# EAGLE design untitled (EAGLE 9.6.2)
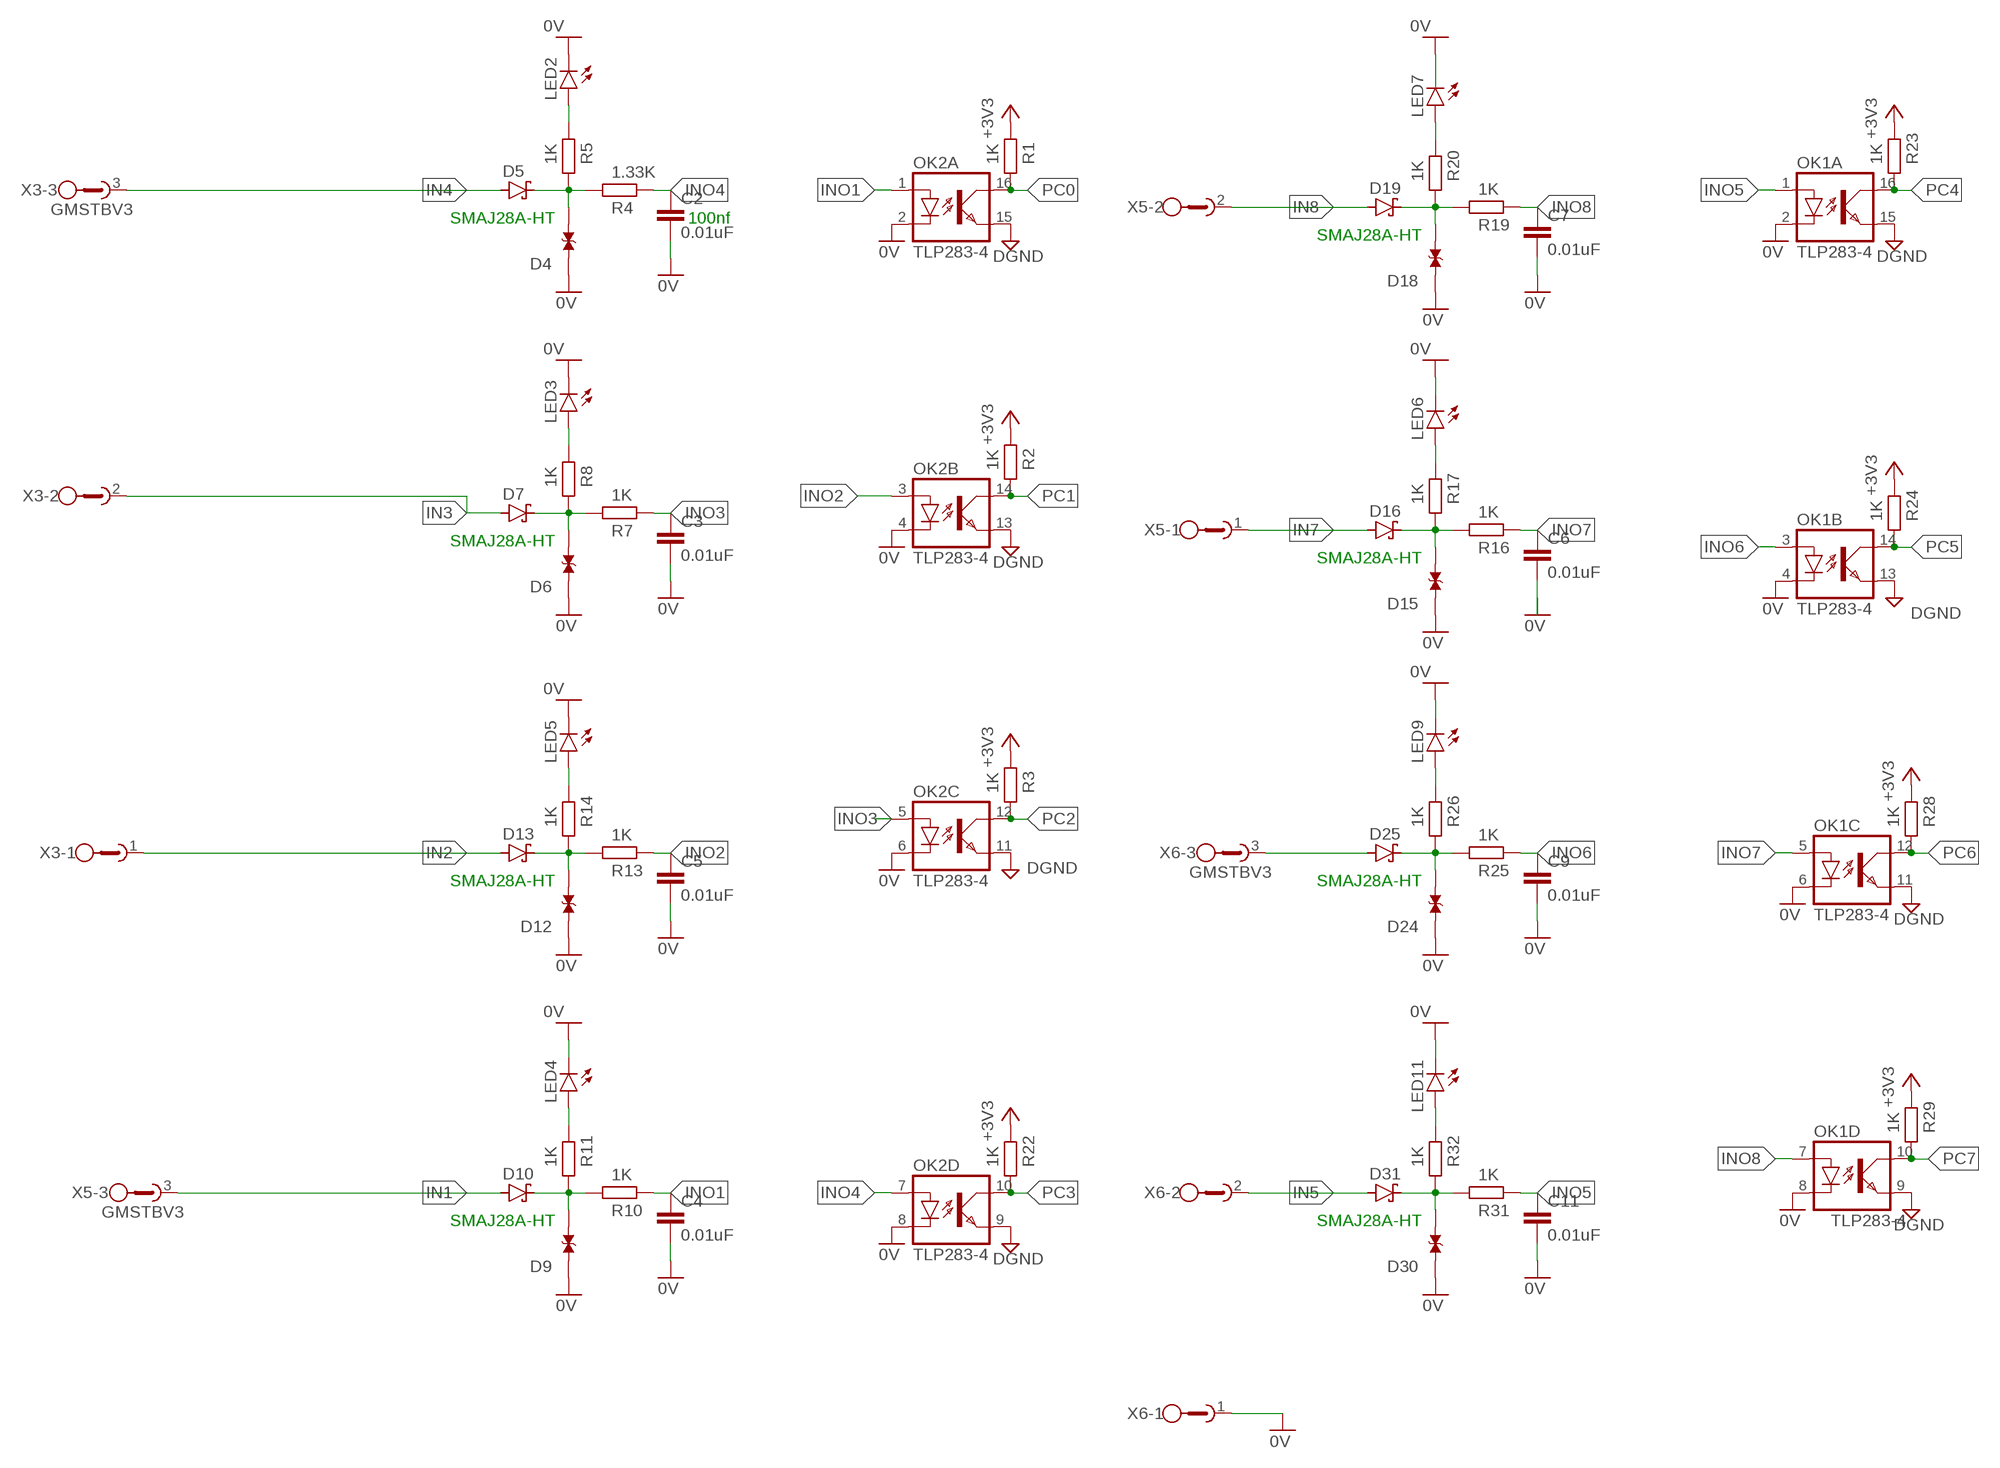
[diagram p0: schematic, sheet 1, part 1 of 2]
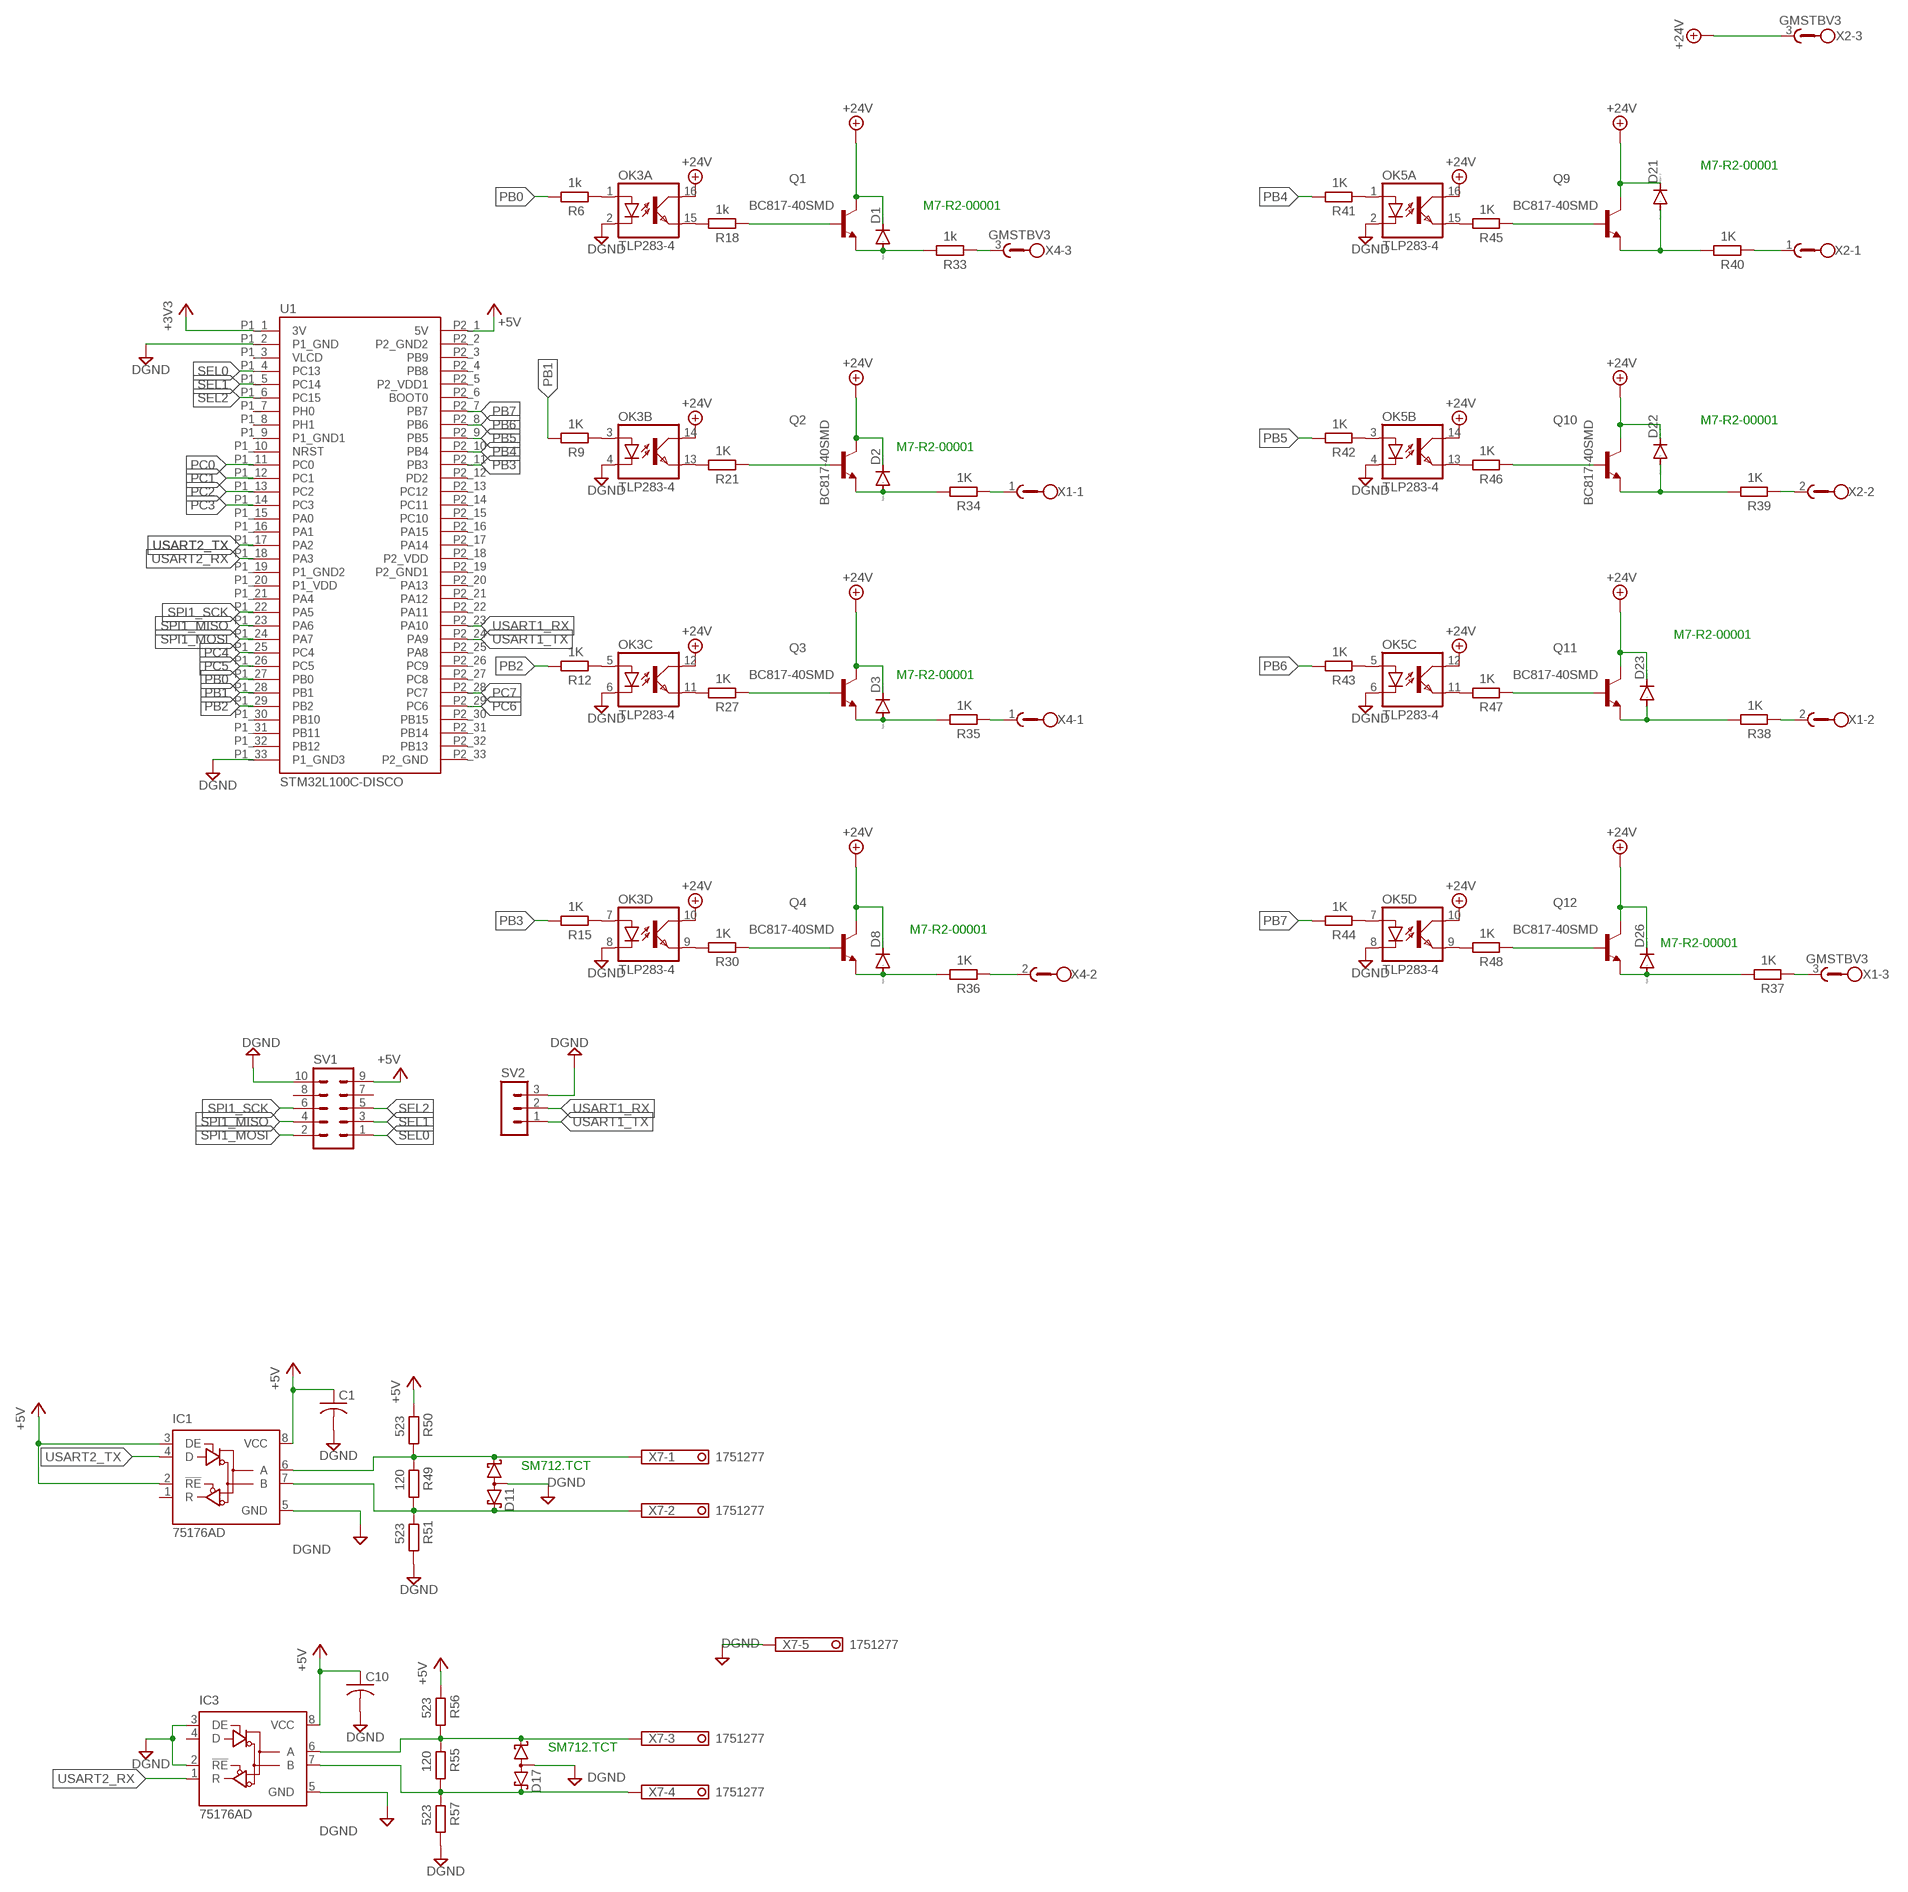
[diagram p1: schematic, sheet 1, part 2 of 2]

## Parts
C1  C-USC0805  [C0805]
C2  0.01uF  C-EUC0805  [C0805]
C3  0.01uF  C-EUC0805  [C0805]
C4  0.01uF  C-EUC0805  [C0805]
C5  0.01uF  C-EUC0805  [C0805]
C6  0.01uF  C-EUC0805  [C0805]
C7  0.01uF  C-EUC0805  [C0805]
C9  0.01uF  C-EUC0805  [C0805]
C10  C-USC0805  [C0805]
C11  0.01uF  C-EUC0805  [C0805]
D1  S1M  [SMA]
D2  S1M  [SMA]
D3  S1M  [SMA]
D4  SMAJ28CA  [DIOM4325X250N]
D5  SCHOTTKY-DIODESMD  [SMB]
D6  SMAJ28CA  [DIOM4325X250N]
D7  SCHOTTKY-DIODESMD  [SMB]
D8  S1M  [SMA]
D9  SMAJ28CA  [DIOM4325X250N]
D10  SCHOTTKY-DIODESMD  [SMB]
D11  BAS40-06  [SOT23]
D12  SMAJ28CA  [DIOM4325X250N]
D13  SCHOTTKY-DIODESMD  [SMB]
D15  SMAJ28CA  [DIOM4325X250N]
D16  SCHOTTKY-DIODESMD  [SMB]
D17  BAS40-06  [SOT23]
D18  SMAJ28CA  [DIOM4325X250N]
D19  SCHOTTKY-DIODESMD  [SMB]
D21  S1M  [SMA]
D22  S1M  [SMA]
D23  S1M  [SMA]
D24  SMAJ28CA  [DIOM4325X250N]
D25  SCHOTTKY-DIODESMD  [SMB]
D26  S1M  [SMA]
D30  SMAJ28CA  [DIOM4325X250N]
D31  SCHOTTKY-DIODESMD  [SMB]
IC1  75176AD  [D_R-PDSO-G8]
IC3  75176AD  [D_R-PDSO-G8]
LED2  LEDCHIP-LED0805  [CHIP-LED0805]
LED3  LEDCHIP-LED0805  [CHIP-LED0805]
LED4  LEDCHIP-LED0805  [CHIP-LED0805]
LED5  LEDCHIP-LED0805  [CHIP-LED0805]
LED6  LEDCHIP-LED0805  [CHIP-LED0805]
LED7  LEDCHIP-LED0805  [CHIP-LED0805]
LED9  LEDCHIP-LED0805  [CHIP-LED0805]
LED11  LEDCHIP-LED0805  [CHIP-LED0805]
OK1  TLP283-4  [MINI-FLAT-16]
OK2  TLP283-4  [MINI-FLAT-16]
OK3  TLP283-4  [MINI-FLAT-16]
OK5  TLP283-4  [MINI-FLAT-16]
Q1  BC817-40SMD  [SOT23-BEC]
Q2  BC817-40SMD  [SOT23-BEC]
Q3  BC817-40SMD  [SOT23-BEC]
Q4  BC817-40SMD  [SOT23-BEC]
Q9  BC817-40SMD  [SOT23-BEC]
Q10  BC817-40SMD  [SOT23-BEC]
Q11  BC817-40SMD  [SOT23-BEC]
Q12  BC817-40SMD  [SOT23-BEC]
R1  1K  R-EU_R0805  [R0805]
R2  1K  R-EU_R0805  [R0805]
R3  1K  R-EU_R0805  [R0805]
R4  1.33K  R-EU_R0805  [R0805]
R5  1K  R-EU_R0805  [R0805]
R6  1k  R-EU_R0805  [R0805]
R7  1K  R-EU_R0805  [R0805]
R8  1K  R-EU_R0805  [R0805]
R9  1K  R-EU_R0805  [R0805]
R10  1K  R-EU_R0805  [R0805]
R11  1K  R-EU_R0805  [R0805]
R12  1K  R-EU_R0805  [R0805]
R13  1K  R-EU_R0805  [R0805]
R14  1K  R-EU_R0805  [R0805]
R15  1K  R-EU_R0805  [R0805]
R16  1K  R-EU_R0805  [R0805]
R17  1K  R-EU_R0805  [R0805]
R18  1k  R-EU_R0805  [R0805]
R19  1K  R-EU_R0805  [R0805]
R20  1K  R-EU_R0805  [R0805]
R21  1K  R-EU_R0805  [R0805]
R22  1K  R-EU_R0805  [R0805]
R23  1K  R-EU_R0805  [R0805]
R24  1K  R-EU_R0805  [R0805]
R25  1K  R-EU_R0805  [R0805]
R26  1K  R-EU_R0805  [R0805]
R27  1K  R-EU_R0805  [R0805]
R28  1K  R-EU_R0805  [R0805]
R29  1K  R-EU_R0805  [R0805]
R30  1K  R-EU_R0805  [R0805]
R31  1K  R-EU_R0805  [R0805]
R32  1K  R-EU_R0805  [R0805]
R33  1k  R-EU_R0805  [R0805]
R34  1K  R-EU_R0805  [R0805]
R35  1K  R-EU_R0805  [R0805]
R36  1K  R-EU_R0805  [R0805]
R37  1K  R-EU_R0805  [R0805]
R38  1K  R-EU_R0805  [R0805]
R39  1K  R-EU_R0805  [R0805]
R40  1K  R-EU_R0805  [R0805]
R41  1K  R-EU_R0805  [R0805]
R42  1K  R-EU_R0805  [R0805]
R43  1K  R-EU_R0805  [R0805]
R44  1K  R-EU_R0805  [R0805]
R45  1K  R-EU_R0805  [R0805]
R46  1K  R-EU_R0805  [R0805]
R47  1K  R-EU_R0805  [R0805]
R48  1K  R-EU_R0805  [R0805]
R49  120  R-EU_R0805  [R0805]
R50  523  R-EU_R0805  [R0805]
R51  523  R-EU_R0805  [R0805]
R55  120  R-EU_R0805  [R0805]
R56  523  R-EU_R0805  [R0805]
R57  523  R-EU_R0805  [R0805]
SV1  MA05-2  [MA05-2]
SV2  MA03-1  [MA03-1]
U1  STM32L100C-DISCO  [DEV_STM32L100C-DISCO]
X1  GMSTBV3  [GMSTBV3]
X2  GMSTBV3  [GMSTBV3]
X3  GMSTBV3  [GMSTBV3]
X4  GMSTBV3  [GMSTBV3]
X5  GMSTBV3  [GMSTBV3]
X6  GMSTBV3  [GMSTBV3]
X7  1751277  [1751277]

## Nets
0V: C2.2 C3.2 C4.2 C5.2 C6.2 C7.2 C9.2 C11.2 D4.1 D6.1 D9.1 D12.1 D15.1 D18.1 D24.1 D30.1 LED2.C LED3.C LED4.C LED5.C LED6.C LED7.C LED9.C LED11.C OK1.2(A:C) OK1.4(B:C) OK1.6(C:C) OK1.8(D:C) OK2.2(A:C) OK2.4(B:C) OK2.6(C:C) OK2.8(D:C) X6.1
+3V3: R1.2 R2.2 R3.2 R22.2 R23.2 R24.2 R28.2 R29.2 U1.P1_1(3V)
+5V: C1.1 C10.1 IC1.2(!RE) IC1.3(DE) IC1.8(VCC) IC3.8(VCC) R50.2 R56.2 SV1.9 U1.P2_1(5V)
+24V: D1.C D2.C D3.C D8.C D21.C D22.C D23.C D26.C OK3.10(D:COL) OK3.12(C:COL) OK3.14(B:COL) OK3.16(A:COL) OK5.10(D:COL) OK5.12(C:COL) OK5.14(B:COL) OK5.16(A:COL) Q1.C Q2.C Q3.C Q4.C Q9.C Q10.C Q11.C Q12.C X2.3
DGND: C1.2 C10.2 D11.3(AA) D17.3(AA) IC1.5(GND) IC3.2(!RE) IC3.3(DE) IC3.5(GND) OK1.9(D:EMIT) OK1.11(C:EMIT) OK1.13(B:EMIT) OK1.15(A:EMIT) OK2.9(D:EMIT) OK2.11(C:EMIT) OK2.13(B:EMIT) OK2.15(A:EMIT) OK3.2(A:C) OK3.4(B:C) OK3.6(C:C) OK3.8(D:C) OK5.2(A:C) OK5.4(B:C) OK5.6(C:C) OK5.8(D:C) R51.1 R57.1 SV1.10 SV2.3 U1.P1_2(P1_GND) U1.P1_33(P1_GND3) X7.5
IN1: D10.A X5.3
IN2: D13.A X3.1
IN3: D7.A X3.2
IN4: D5.A X3.3
IN5: D31.A X6.2
IN7: D16.A X5.1
IN8: D19.A X5.2
INO1: C4.1 OK2.1(A:A) R10.2
INO2: C5.1 OK2.3(B:A) R13.2
INO3: C3.1 OK2.5(C:A) R7.2
INO4: C2.1 OK2.7(D:A) R4.2
INO5: C11.1 OK1.1(A:A) R31.2
INO6: C9.1 OK1.3(B:A) R25.2
INO7: C6.1 OK1.5(C:A) R16.2
INO8: C7.1 OK1.7(D:A) R19.2
N$2: LED2.A R5.2
N$3: LED3.A R8.2
N$4: LED4.A R11.2
N$5: LED5.A R14.2
N$6: LED6.A R17.2
N$7: LED7.A R20.2
N$9: LED9.A R26.2
N$11: LED11.A R32.2
N$17: D4.2 D5.C R4.1 R5.1
N$18: D6.2 D7.C R7.1 R8.1
N$19: D12.2 D13.C R13.1 R14.1
N$20: D9.2 D10.C R10.1 R11.1
N$21: D18.2 D19.C R19.1 R20.1
N$22: D15.2 D16.C R16.1 R17.1
N$23: D24.2 D25.C R25.1 R26.1
N$24: D30.2 D31.C R31.1 R32.1
N$25: OK3.1(A:A) R6.2
N$26: OK3.3(B:A) R9.2
N$27: OK3.5(C:A) R12.2
N$28: OK3.7(D:A) R15.2
N$29: OK3.15(A:EMIT) R18.1
N$30: OK3.13(B:EMIT) R21.1
N$31: OK3.11(C:EMIT) R27.1
N$32: OK3.9(D:EMIT) R30.1
N$33: Q4.B R30.2
N$34: Q3.B R27.2
N$35: Q2.B R21.2
N$36: Q1.B R18.2
N$37: R33.2 X4.3
N$38: R34.2 X1.1
N$39: R35.2 X4.1
N$40: D25.A X6.3
N$41: OK5.1(A:A) R41.2
N$42: OK5.15(A:EMIT) R45.1
N$43: OK5.3(B:A) R42.2
N$44: OK5.13(B:EMIT) R46.1
N$45: OK5.5(C:A) R43.2
N$46: OK5.11(C:EMIT) R47.1
N$47: OK5.7(D:A) R44.2
N$48: OK5.9(D:EMIT) R48.1
N$49: D1.A Q1.E R33.1
N$50: R36.2 X4.2
N$51: D2.A Q2.E R34.1
N$52: D3.A Q3.E R35.1
N$53: D8.A Q4.E R36.1
N$54: D26.A Q12.E R37.1
N$55: D23.A Q11.E R38.1
N$56: D22.A Q10.E R39.1
N$65: Q12.B R48.2
N$66: Q11.B R47.2
N$67: Q10.B R46.2
N$68: Q9.B R45.2
N$69: R37.2 X1.3
N$70: R38.2 X1.2
N$71: R39.2 X2.2
N$72: R40.2 X2.1
N$73: D21.A Q9.E R40.1
N$75: D11.1(K1) IC1.6(A) R49.2 R50.1 X7.1
N$76: D11.2(K2) IC1.7(B) R49.1 R51.2 X7.2
N$78: D17.1(K1) IC3.6(A) R55.2 R56.1 X7.3
N$79: D17.2(K2) IC3.7(B) R55.1 R57.2 X7.4
PB0: R6.1 U1.P1_27(PB0)
PB1: R9.1 U1.P1_28(PB1)
PB2: R12.1 U1.P1_29(PB2)
PB3: R15.1 U1.P2_11(PB3)
PB4: R41.1 U1.P2_10(PB4)
PB5: R42.1 U1.P2_9(PB5)
PB6: R43.1 U1.P2_8(PB6)
PB7: R44.1 U1.P2_7(PB7)
PC0: OK2.16(A:COL) R1.1 U1.P1_11(PC0)
PC1: OK2.14(B:COL) R2.1 U1.P1_12(PC1)
PC2: OK2.12(C:COL) R3.1 U1.P1_13(PC2)
PC3: OK2.10(D:COL) R22.1 U1.P1_14(PC3)
PC4: OK1.16(A:COL) R23.1 U1.P1_25(PC4)
PC5: OK1.14(B:COL) R24.1 U1.P1_26(PC5)
PC6: OK1.12(C:COL) R28.1 U1.P2_29(PC6)
PC7: OK1.10(D:COL) R29.1 U1.P2_28(PC7)
SEL0: SV1.1 U1.P1_4(PC13)
SEL1: SV1.3 U1.P1_5(PC14)
SEL2: SV1.5 U1.P1_6(PC15)
SPI1_MISO: SV1.4 U1.P1_23(PA6)
SPI1_MOSI: SV1.2 U1.P1_24(PA7)
SPI1_SCK: SV1.6 U1.P1_22(PA5)
USART1_RX: SV2.2 U1.P2_23(PA10)
USART1_TX: SV2.1 U1.P2_24(PA9)
USART2_RX: IC3.1(R) U1.P1_18(PA3)
USART2_TX: IC1.4(D) U1.P1_17(PA2)
Unconnected: IC1.1(R) IC3.4(D) SV1.7 SV1.8 U1.P1_7(PH0) U1.P1_8(PH1) U1.P1_10(NRST) U1.P1_15(PA0) U1.P1_16(PA1) U1.P1_21(PA4) U1.P1_30(PB10) U1.P1_31(PB11) U1.P1_32(PB12) U1.P2_3(PB9) U1.P2_4(PB8) U1.P2_6(BOOT0) U1.P2_12(PD2) U1.P2_13(PC12) U1.P2_14(PC11) U1.P2_15(PC10) U1.P2_16(PA15) U1.P2_17(PA14) U1.P2_20(PA13) U1.P2_21(PA12) U1.P2_22(PA11) U1.P2_25(PA8) U1.P2_26(PC9) U1.P2_27(PC8) U1.P2_30(PB15) U1.P2_31(PB14) U1.P2_32(PB13)

## Notes on the sheet
- M7-R2-00001
- M7-R2-00001
- SMAJ28A-HT | 100nf
- SMAJ28A-HT
- M7-R2-00001
- M7-R2-00001
- SMAJ28A-HT
- SMAJ28A-HT
- M7-R2-00001
- M7-R2-00001
- SMAJ28A-HT | SMAJ28A-HT
- M7-R2-00001
- M7-R2-00001
- SMAJ28A-HT | SMAJ28A-HT
- SM712.TCT
- SM712.TCT

## Power pins joined to a net without a drawn wire
P1_GND1: U1.P1_9(P1_GND1)
P1_GND2: U1.P1_19(P1_GND2)
P1_VDD: U1.P1_20(P1_VDD)
P2_GND: U1.P2_33(P2_GND)
P2_GND1: U1.P2_19(P2_GND1)
P2_GND2: U1.P2_2(P2_GND2)
P2_VDD: U1.P2_18(P2_VDD)
P2_VDD1: U1.P2_5(P2_VDD1)
VLCD: U1.P1_3(VLCD)

## Library data of the parts
C1 C10 = rcl:C-US: CAPACITOR, American symbol; SPICEPREFIX: C
C2-C7 C9 C11 = rcl:C-EU: CAPACITOR, European symbol; SPICEPREFIX: C
D1-D3 D8 D21-D23 D26 = diode:S1M
D4 D6 D9 D12 D15 D18 D24 D30 = SMAJ28CA:SMAJ28CA: Check availability <https://pricing.snapeda.com/parts/SMAJ28CA/Littelfuse/view-part?ref=eda>; AVAILABILITY: In Stock; DESCRIPTION: 45.4V Clamp 8.8A Ipp Tvs Diode Surface Mount DO-214AC (SMA); MF: Littelfuse; MP: SMAJ28CA; PACKAGE: DO-214 Littelfuse; PRICE: None; PURCHASE-URL: https://pricing.snapeda.com/search/part/SMAJ28CA/?ref=eda
D5 D7 D10 D13 D16 D19 D25 D31 = diode:SCHOTTKY-DIODE: Schottky Diode
D11 D17 = diode:BAS40-06: Silicon Schottky Diodes General-purpose diode for high-speed switching
IC1 IC3 = 751xx:75176A: DIFFERENTIAL BUS TRANSCEIVER Source: http://focus.ti.com/lit/ds/symlink/sn75176a.pdf
LED2-LED7 LED9 LED11 = led:LED: LED OSRAM: - CHIPLED LG R971, LG N971, LY N971, LG Q971, LY Q971, LO R971, LY R971 LH N974, LH R974 LS Q976, LO Q976, LY Q976 LO Q996 - Hyper CHIPLED LW Q18S LB Q993, LB Q99A, LB R99A - SideLED LS A670, LO A670, LY A670, LG A670, LP A670 LB A673, LV A673, LT A673, LW A673 LH A674 LY A675 LS A676, LA A676, LO A676, LY A676, LW A676 LS A679, LY A679, LG A679 - Hyper Micro SIDELED® LS Y876, LA Y876, LO Y876, LY Y876 LT Y87S - SmartLED LW L88C, LW L88S LB L89C, LB L89S, LG L890 LS L89K, LO L89K, LY L89K LS L896, LA L896, LO L896, LY L896 - TOPLED LS T670, LO T670, LY T670, LG T670, LP T670 LSG T670, LSP T670, LSY T670, LOP T670, LYG T670 LG T671, LOG T671, LSG T671 LB T673, LV T673, LT T673, LW T673 LH T674 LS T676, LA T676, LO T676, LY T676, LB T676, LH T676, LSB T676, LW T676 LB T67C, LV T67C, LT T67C, LS T67K, LO T67K, LY T67K, LW E67C LS E67B, LA E67B, LO E67B, LY E67B, LB E67C, LV E67C, LT E67C LW T67C LS T679, LY T679, LG T679 LS T770, LO T770, LY T770, LG T770, LP T770 LB T773, LV T773, LT T773, LW T773 LH T774 LS E675, LA E675, LY E675, LS T675 LS T776, LA T776, LO T776, LY T776, LB T776 LHGB T686 LT T68C, LB T68C - Hyper Mini TOPLED® LB M676 - Mini TOPLED Santana® LG M470 LS M47K, LO M47K, LY M47K Source: http://www.osram.convergy.de LUXEON: - LUMILED® LXK2-PW12-R00, LXK2-PW12-S00, LXK2-PW14-U00, LXK2-PW14-V00 LXK2-PM12-R00, LXK2-PM12-S00, LXK2-PM14-U00 LXK2-PE12-Q00, LXK2-PE12-R00, LXK2-PE12-S00, LXK2-PE14-T00, LXK2-PE14-U00 LXK2-PB12-K00, LXK2-PB12-L00, LXK2-PB12-M00, LXK2-PB14-N00, LXK2-PB14-P00, LXK2-PB14-Q00 LXK2-PR12-L00, LXK2-PR12-M00, LXK2-PR14-Q00, LXK2-PR14-R00 LXK2-PD12-Q00, LXK2-PD12-R00, LXK2-PD12-S00 LXK2-PH12-R00, LXK2-PH12-S00 LXK2-PL12-P00, LXK2-PL12-Q00, LXK2-PL12-R00 Source: www.luxeon.com KINGBRIGHT: KA-3528ASYC Source: www.kingbright.com
OK1-OK3 OK5 = optocoupler:TLP283-4: TOSHIBA PHOTOCOUPLER GaAs IRED & PHOTO-TRANSISTOR Source: http://www.semicon.toshiba.co.jp/td/en/Opto/Photocoupler/en_20050928_TLP283_datasheet.pdf; OC_FARNELL: unknown; OC_NEWARK: unknown
Q1-Q4 Q9-Q12 = transistor-npn:BC817*: NPN Transistor
R1-R51 R55-R57 = rcl:R-EU_: RESISTOR, European symbol; SPICEPREFIX: R
SV1 = con-lstb:MA05-2: PIN HEADER; OC_FARNELL: unknown; OC_NEWARK: unknown
SV2 = con-lstb:MA03-1: PIN HEADER; OC_FARNELL: unknown; OC_NEWARK: unknown
U1 = STM32L100C-DISCO:STM32L100C-DISCO: STM32L100RCT6 Microcontroller Discovery Kit 16KB RAM 256KB Flash Win 7/Win Vista/Win XP OS Check availability <https://pricing.snapeda.com/parts/STM32L100C-DISCO/STMicroelectronics/view-part?ref=eda>; AVAILABILITY: In Stock; DESCRIPTION: STM32L100 Discovery STM32L1 ARM® Cortex®-M3 MCU 32-Bit Embedded Evaluation Board; MF: STMicroelectronics; MP: STM32L100C-DISCO; PACKAGE: None; PRICE: None; PURCHASE-URL: https://pricing.snapeda.com/search/part/STM32L100C-DISCO/?ref=eda
X1-X6 = con-phoenix-762:GMSTBV3: PHOENIX; MPN: GMSTBVA2,5/3-G-7,62; OC_FARNELL: 1793080; OC_NEWARK: 69R9521
X7 = con-phoenix-350:1751277: MKDS 1/ 5-3,5 Printklemme Nennstrom: 10 A Bemessungsspannung: 160 V Raster: 3,5 mm Polzahl: 5 Montageart: Löten Anschlussart: Schraubanschluss Anschlussrichtung vom Leiter zur Platine: 0° Source: http://eshop.phoenixcontact.com .. 1751277.pdf; OC_FARNELL: unknown; OC_NEWARK: unknown

## Board
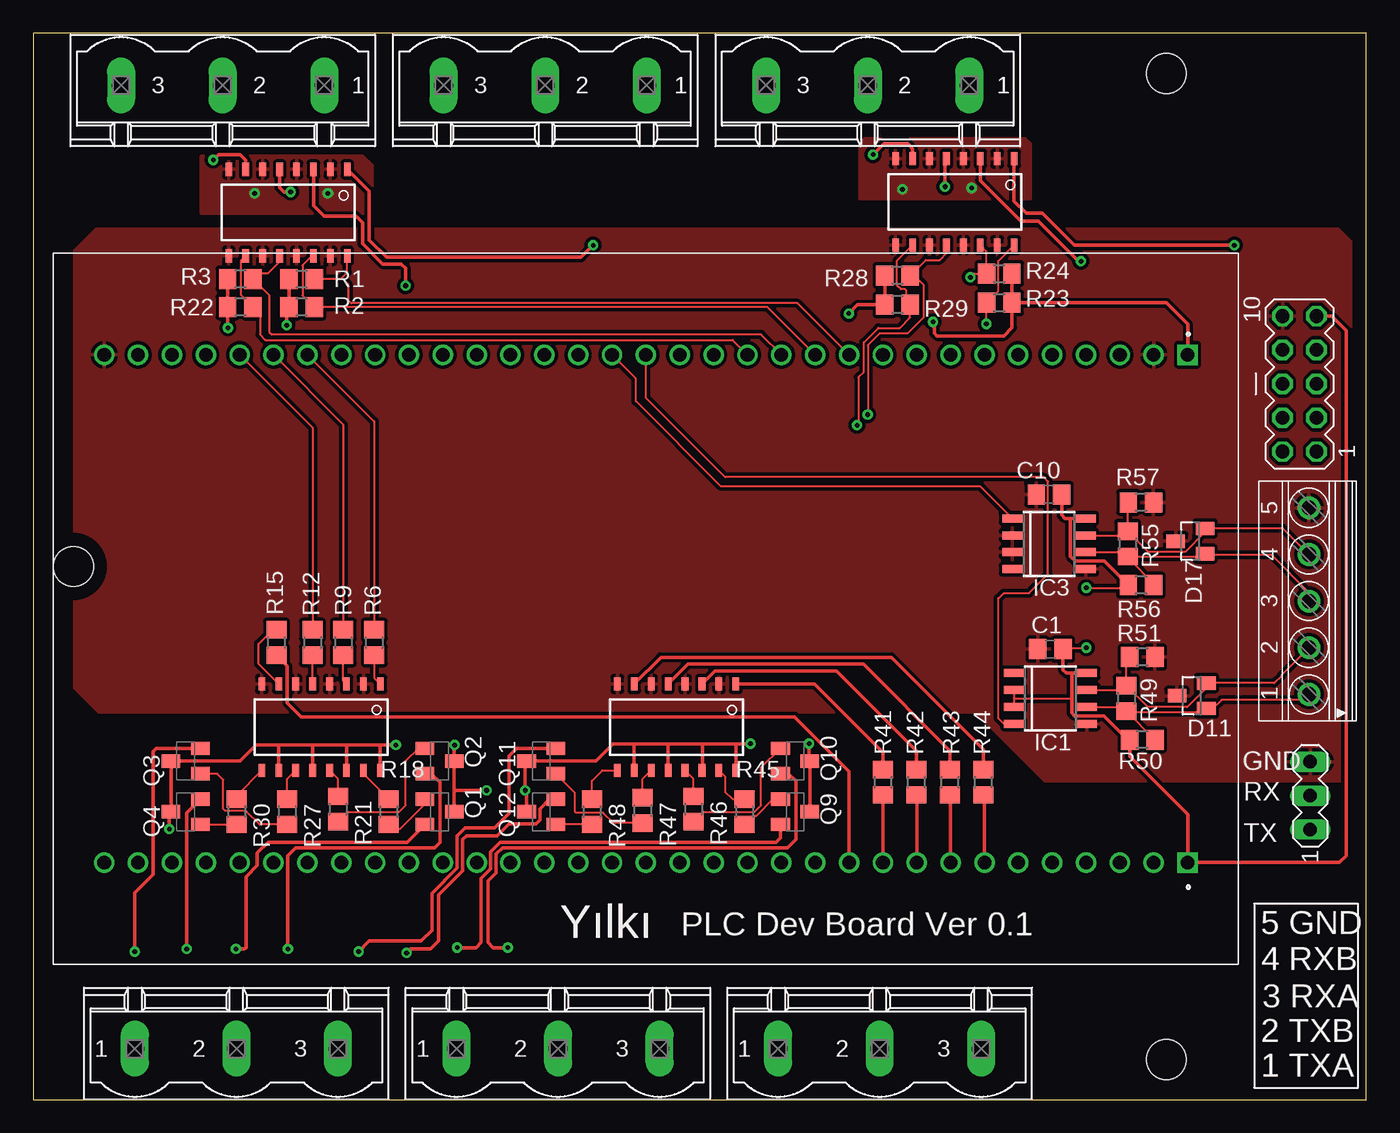
[diagram p2: board, top side]
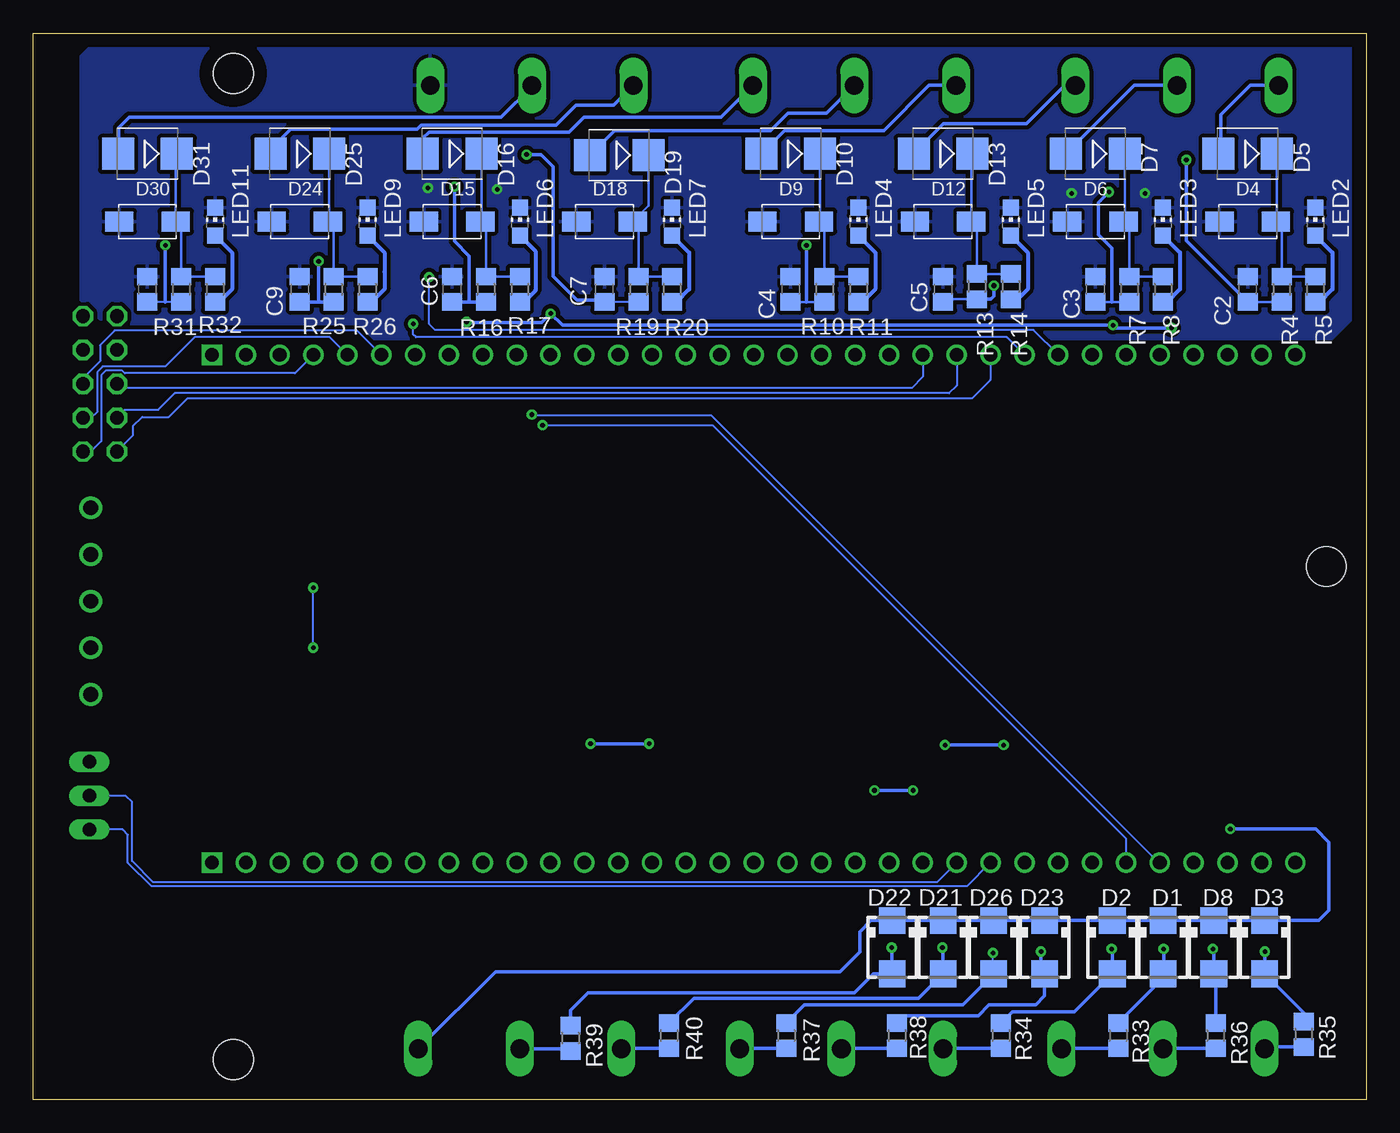
[diagram p3: board, bottom side, seen from below]

Size 100 x 80 mm. Coordinates in mm from the lower left corner, seen from the top.
Outline: 0,0 100,0 100,80 0,80 0,0
Copper layers (1*16): Top 0.035mm / dielectric 1.5mm / Bottom 0.035mm
Design rules "default": minimum track width 6mil, minimum drill 0.35mm, track to track 6mil, track to pad 6mil, pad to pad 6mil, via to via 6mil, smd to smd 6mil, copper to edge 40mil, drill to drill 6mil, minimum pad ring 10mil, minimum via ring 8mil, stop-mask expansion 4mil, vias tented up to drill 0mil, thermal gap 10mil
Holes 3 mm at 3,40 85,3 85,77

### Footprints (pad centres in the part's own frame; a part is rotated, then mirrored left to right if it is on the bottom)
C0805 = smd 1.3 x 1.5: 1 -0.95,0; 2 0.95,0
SMA = smd 2 x 2: A 2,0; C -2,0
DIOM4325X250N = smd 2.12 x 1.5: 1 -2.115,0; 2 2.115,0
SMB = smd 2.4 x 2.4: A 2.2,0; C -2.2,0
SOT23 = smd 1 x 1.4: 1 -0.95,-1.1; 2 0.95,-1.1; 3 0,1.1
D_R-PDSO-G8 = smd 0.6 x 1.5: 1 -1.905,-2.75; 2 -0.635,-2.75; 3 0.635,-2.75; 4 1.905,-2.75; 5 1.905,2.75; 6 0.635,2.75; 7 -0.635,2.75; 8 -1.905,2.75
CHIP-LED0805 = smd 1.2 x 1.2: A 0,-1.05; C 0,1.05
MINI-FLAT-16 = smd 1 x 0.5: 1 -3.24,4.445; 2 -3.24,3.175; 3 -3.24,1.905; 4 -3.24,0.635; 5 -3.24,-0.635; 6 -3.24,-1.905; 7 -3.24,-3.175; 8 -3.24,-4.445; 9 3.24,-4.445; 10 3.24,-3.175; 11 3.24,-1.905; 12 3.24,-0.635; 13 3.24,0.635; 14 3.24,1.905; 15 3.24,3.175; 16 3.24,4.445
SOT23-BEC = smd 1 x 1.4: B -0.95,-1.1; C 0,1.1; E 0.95,-1.1
R0805 = smd 1.3 x 1.5: 1 -0.95,0; 2 0.95,0
MA05-2 = drill 1.016 octagon: 1 -5.08,-1.27; 2 -5.08,1.27; 3 -2.54,-1.27; 4 -2.54,1.27; 5 0,-1.27; 6 0,1.27; 7 2.54,-1.27; 8 2.54,1.27; 9 5.08,-1.27; 10 5.08,1.27
MA03-1 = drill 1.016 long: 1 -2.54,0; 2 0,0; 3 2.54,0
DEV_STM32L100C-DISCO = drill 1.02 square: P1_1 -19.05,40.64; P2_1 19.05,40.64 | drill 1.02: P1_2 -19.05,38.1; P1_3 -19.05,35.56; P1_4 -19.05,33.02; P1_5 -19.05,30.48; P1_6 -19.05,27.94; P1_7 -19.05,25.4; P1_8 -19.05,22.86; P1_9 -19.05,20.32; P1_10 -19.05,17.78; P1_11 -19.05,15.24; P1_12 -19.05,12.7; P1_13 -19.05,10.16; P1_14 -19.05,7.62; P1_15 -19.05,5.08; P1_16 -19.05,2.54; P1_17 -19.05,0; P1_18 -19.05,-2.54; P1_19 -19.05,-5.08; P1_20 -19.05,-7.62; P1_21 -19.05,-10.16; P1_22 -19.05,-12.7; P1_23 -19.05,-15.24; P1_24 -19.05,-17.78; P1_25 -19.05,-20.32; P1_26 -19.05,-22.86; P1_27 -19.05,-25.4; P1_28 -19.05,-27.94; P1_29 -19.05,-30.48; P1_30 -19.05,-33.02; P1_31 -19.05,-35.56; P1_32 -19.05,-38.1; P1_33 -19.05,-40.64; P2_2 19.05,38.1; P2_3 19.05,35.56; P2_4 19.05,33.02; P2_5 19.05,30.48; P2_6 19.05,27.94; P2_7 19.05,25.4; P2_8 19.05,22.86; P2_9 19.05,20.32; P2_10 19.05,17.78; P2_11 19.05,15.24; P2_12 19.05,12.7; P2_13 19.05,10.16; P2_14 19.05,7.62; P2_15 19.05,5.08; P2_16 19.05,2.54; P2_17 19.05,0; P2_18 19.05,-2.54; P2_19 19.05,-5.08; P2_20 19.05,-7.62; P2_21 19.05,-10.16; P2_22 19.05,-12.7; P2_23 19.05,-15.24; P2_24 19.05,-17.78; P2_25 19.05,-20.32; P2_26 19.05,-22.86; P2_27 19.05,-25.4; P2_28 19.05,-27.94; P2_29 19.05,-30.48; P2_30 19.05,-33.02; P2_31 19.05,-35.56; P2_32 19.05,-38.1; P2_33 19.05,-40.64
GMSTBV3 = drill 1.397 long: 1 -7.62,0; 2 0,0; 3 7.62,0
1751277 = drill 1.1 pad 1.7: 1 -7,-0.1; 2 -3.5,-0.1; 3 0,-0.1; 4 3.5,-0.1; 5 7,-0.1

### Placement (x,y rotation side)
C1  76.3,33.8 180 top
C2  8.89,60.8 90 bottom
C3  20.32,60.8 90 bottom
C4  43.18,60.8 90 bottom
C5  31.75,60.8 90 bottom
C6  68.58,60.8 90 bottom
C7  57.15,60.8 90 bottom
C9  80.01,60.8 90 bottom
C10  76.2,45.4 180 top
C11  91.44,60.8 90 bottom
D1  15.24,11.43 270 bottom
D2  19.05,11.43 270 bottom
D3  7.62,11.43 270 bottom
D4  8.89,65.88 0 bottom
D5  8.89,70.96 180 bottom
D6  20.32,65.88 0 bottom
D7  20.32,70.96 180 bottom
D8  11.43,11.43 270 bottom
D9  43.18,65.88 0 bottom
D10  43.18,70.96 180 bottom
D11  86.9,30.3 90 top
D12  31.75,65.88 0 bottom
D13  31.75,70.96 180 bottom
D15  68.58,65.88 0 bottom
D16  68.58,70.96 180 bottom
D17  86.8,41.9 90 top
D18  57.15,65.88 0 bottom
D19  56.05,70.86 180 bottom
D21  31.75,11.43 270 bottom
D22  35.56,11.43 270 bottom
D23  24.13,11.43 270 bottom
D24  80.01,65.88 0 bottom
D25  80.01,70.96 180 bottom
D26  27.94,11.43 270 bottom
D30  91.44,65.88 0 bottom
D31  91.44,70.96 180 bottom
IC1  76.3,30.1 270 top
IC3  76.2,41.7 270 top
LED2  3.81,65.88 0 bottom
LED3  15.24,65.88 0 bottom
LED4  38.1,65.88 0 bottom
LED5  26.67,65.88 0 bottom
LED6  63.5,65.88 0 bottom
LED7  52.07,65.88 0 bottom
LED9  74.93,65.88 0 bottom
LED11  86.36,65.88 0 bottom
OK1  69.14,67.35 270 top
OK2  19.11,66.55 270 top
OK3  21.59,27.94 270 top
OK5  48.26,27.94 270 top
Q1  30.48,21.59 270 top
Q2  30.48,25.4 270 top
Q3  11.43,25.4 90 top
Q4  11.43,21.59 90 top
Q9  57.15,21.59 270 top
Q10  57.15,25.4 270 top
Q11  38.1,25.4 90 top
Q12  38.1,21.59 90 top
R1  20.13,61.54 180 top
R2  20.13,59.45 180 top
R3  15.53,61.56 180 top
R4  6.35,60.8 270 bottom
R5  3.81,60.8 270 bottom
R6  25.57,34.29 270 top
R7  17.78,60.8 270 bottom
R8  15.24,60.8 270 bottom
R9  23.26,34.29 270 top
R10  40.64,60.8 270 bottom
R11  38.1,60.8 270 bottom
R12  20.95,34.29 270 top
R13  29.21,61 270 bottom
R14  26.67,61 270 bottom
R15  18.24,34.29 90 top
R16  66.04,60.8 270 bottom
R17  63.5,60.8 270 bottom
R18  26.67,21.59 270 top
R19  54.61,60.8 270 bottom
R20  52.07,60.8 270 bottom
R21  22.86,21.79 270 top
R22  15.53,59.47 180 top
R23  72.47,59.79 0 top
R24  72.47,61.98 0 top
R25  77.47,60.8 270 bottom
R26  74.93,60.8 270 bottom
R27  19.05,21.59 270 top
R28  64.83,61.83 180 top
R29  64.83,59.64 180 top
R30  15.24,21.59 270 top
R31  88.9,60.8 270 bottom
R32  86.36,60.8 270 bottom
R33  18.6,4.8 270 bottom
R34  27.4,4.8 270 bottom
R35  4.7,4.9 270 bottom
R36  11.3,4.8 270 bottom
R37  43.5,4.8 270 bottom
R38  35.2,4.8 270 bottom
R39  59.7,4.6 270 bottom
R40  52.3,4.8 270 bottom
R41  63.76,23.81 90 top
R42  66.27,23.81 90 top
R43  68.78,23.81 90 top
R44  71.29,23.81 90 top
R45  53.34,21.59 270 top
R46  49.53,21.79 270 top
R47  45.72,21.69 270 top
R48  41.91,21.59 270 top
R49  82,30.1 270 top
R50  83.2,27 180 top
R51  83.2,33.2 180 top
R55  82.1,41.7 270 top
R56  83.1,38.6 180 top
R57  83.1,44.8 180 top
SV1  95,53.7 90 top
SV2  95.8,22.8 90 top
U1  45.96,36.83 270 top
X1  39.37,3.81 0 top
X2  63.5,3.81 0 top
X3  14.2,76.1 180 top
X4  15.24,3.81 0 top
X5  38.4,76.1 180 top
X6  62.6,76.1 180 top
X7  95.6,37.4 90 top

### Tracks (layer width: path | path; a pad name or v marks a point on that pad's centre or on a via)
0V  (via drill 0.35)
  other vias: 16.6,68 22.1,68 65.2,68.3 70.4,68.4
  pour Bottom (isolate 0.305): 2.1,80 94.7,80 96.4,78.3 96.4,60 93.5,57.1 2.6,57.1 1.2,58.5 1.2,79.1
  pour Top (isolate 0.254): 12.6,66.5 25.4,66.5 25.4,70.1 24.7,70.8 12.6,70.8
  pour Top (isolate 0.254): 62,67.6 74.8,67.6 74.8,71.7 74.4,72.1 62.4,72.1 62.2,71.9 62,71.7
+3V3  (via drill 0.35)
  Top 0.254: U1.P1_1 86.6,58.2 85.01,59.79 R23.2 | v19,58.1 19,59.27 R2.2 R1.2 | v14.6,57.9 14.58,57.92 R22.2 R3.2 | R28.2 R29.2 61.84,59.64 v61.18,58.98 | R23.2 R24.2 | v67.5,58.35 67.6,58.25 67.6,57.5 67.8,57.3 72.8,57.3 73.42,57.92 R23.2
  Bottom 0.254: v14.6,57.9 18.8,57.9 v19,58.1 60.3,58.1 v61.18,58.98 61.86,58.3 67.45,58.3 v67.5,58.35
+5V  (via drill 0.35)
  Top 0.152: C1.1 77.35,33.9 v79,33.9 | v79,38.4 81.95,38.4 R56.2 | IC1.2 73.55,30.1 | 73.55,30.1 IC1.3 | 73.55,30.1 77.9,30.1
  Top 0.254: IC1.8 77.9,32.01 | 77.9,32.01 77.5,32.01 77.5,32 77.25,32.25 C1.1 | IC3.8 77.8,43.6 | 77.8,43.6 77.39,43.6 77.15,43.85 C10.1 | R56.2 80.35,40.4 78.17,40.4 77.82,40.75 77.82,43.58 77.8,43.6 | 77.9,32.01 77.9,30.1 77.9,29 78.1,28.8 80.3,28.8 82.1,27 R50.2 82.25,25.75 86.6,21.4 U1.P2_1 97.98,17.78 98.5,18.3 98.5,57.7 97.42,58.78 SV1.9
  Bottom 0.152: v79,33.9 v79,38.4
+24V  (via drill 0.35)
  Top 0.254: v10.2,20.3 10.2,21.46 Q4.C Q3.C 15.5,25.4 16.7,26.6 18.4,26.6 | Q12.C 37,23.1 v36.9,23.2 36.9,25.3 Q11.C 42.2,25.4 43.5,26.7 45.1,26.7 | 45.1,26.7 47.7,26.7 | 47.7,26.7 50.2,26.7 | 50.2,26.7 50.2,24.73 OK5.14 | 47.7,26.7 47.62,26.62 OK5.12 | 45.1,26.7 45.09,26.68 OK5.10 | Q9.C Q10.C 58.2,25.45 v58.2,26.7 | v27.2,26.6 26.1,26.6 | 26.1,26.6 23.6,26.6 | 23.6,26.6 21,26.6 | 21,26.6 18.4,26.6 | OK3.10 18.41,26.59 18.4,26.6 | OK3.12 20.95,26.55 21,26.6 | OK3.14 23.5,26.5 23.6,26.6 | OK3.16 26.04,26.54 26.1,26.6 | 50.2,26.7 52.6,26.7 | v53.8,26.7 52.6,26.7 | 52.6,26.7 52.7,26.59 OK5.16 | v31.6,26.6 31.58,26.58 Q2.C 31.58,23.2 | 31.58,23.2 Q1.C | v34,23.2 31.58,23.2
  Bottom 0.254: X2.3 65.33,9.6 39.5,9.6 38,11.1 38,12.6 37.17,13.43 D22.C D21.C D26.C D23.C D2.C 17.1,13.43 D1.C 13.3,13.43 D8.C 9.5,13.43 D3.C 5.2,13.43 3.57,13.43 2.8,14.2 2.8,19.3 3.8,20.3 v10.2,20.3 | v58.2,26.7 v53.8,26.7 | v31.6,26.6 v27.2,26.6 | v34,23.2 v36.9,23.2
DGND
  pour Top (isolate 0.254): 4.9,29.1 70.5,29.1 70.6,29.2 75.9,23.9 100,23.9 100,63.2 97.9,65.3 4.7,65.3 3.1,63.7 3.1,30.9
IN1
  Bottom 0.254: D10.A 43.64,72.7 36.2,72.7 32.8,76.1 X5.3
IN2
  Bottom 0.254: D13.A 31.71,73.2 25.5,73.2 22.6,76.1 X3.1
IN3
  Bottom 0.254: D7.A 17.38,76.1 X3.2
IN4
  Bottom 0.254: D5.A 10.9,71.15 10.9,73.9 8.7,76.1 X3.3
IN5
  Bottom 0.254: X6.2 62.6,76 64.9,73.7 92.8,73.7 93.6,72.9 93.6,70.96 D31.A
IN7
  Bottom 0.254: X5.1 48.42,73.7 58.7,73.7 59.8,72.6 70.3,72.6 70.78,72.12 D16.A
IN8
  Bottom 0.254: D19.A 56.41,72.7 44.7,72.7 43.4,74 40.5,74 X5.2
INO1  (via drill 0.35)
  Top 0.254: OK2.1 25.2,68.14 25.2,64.5 26.5,63.2 41.1,63.2 v42,64.1
  Bottom 0.203: R10.2 42,59.85 C4.1
  Bottom 0.254: v42,64.1 42,59.85
INO2  (via drill 0.35)
  Top 0.254: OK2.3 21.02,67.08 21.8,66.3 24.2,66.3 24.7,65.8 24.7,64.2 26.2,62.7 27.6,62.7 27.93,62.37 v27.93,61.06
  Bottom 0.203: C5.1 31.75,59.53 31.23,60.05 R13.2
  Bottom 0.254: v27.93,61.06 27.93,60.27 28.15,60.05 R13.2
INO3  (via drill 0.35)
  Top 0.254: v19.3,68.1 18.8,68.1 18.48,68.42 OK2.5
  Bottom 0.203: C3.1 19.1,59.85 R7.2
  Bottom 0.254: 19.1,59.85 19.1,63.9 20.1,64.9 20.1,67.3 v19.3,68.1
INO4  (via drill 0.35)
  Top 0.254: v13.5,70.5 13.9,70.9 15.5,70.9 15.94,70.47 OK2.7
  Bottom 0.203: R4.2 C2.1
  Bottom 0.254: C2.1 13.5,64.46 v13.5,70.5
INO5  (via drill 0.35)
  Top 0.254: OK1.1 73.58,67.42 74.5,66.5 75.7,66.5 78.1,64.1 v90.1,64.1
  Bottom 0.152: R31.2 90.1,59.85 C11.1
  Bottom 0.254: v90.1,64.1 90.1,59.85
INO6  (via drill 0.35)
  Top 0.254: OK1.3 71.05,68.95 74.1,65.9 75.4,65.9 78.4,62.9 v78.6,62.9
  Bottom 0.254: R25.2 78.6,59.85 | 78.6,59.85 C9.1 | v78.6,62.9 78.6,59.85
INO7  (via drill 0.35)
  Top 0.254: v68.4,68.5 68.4,70.48 OK1.5
  Bottom 0.254: R16.2 67.3,59.85 | 67.3,59.85 C6.1 | 67.3,59.85 67.3,63.3 68.4,64.4 v68.4,68.5
INO8  (via drill 0.35)
  Top 0.254: v63,70.9 63.8,71.7 65.6,71.7 65.97,71.33 OK1.7
  Bottom 0.152: R19.2 C7.1
  Bottom 0.254: C7.1 57.3,60 59.2,60 61,61.8 61,70 61.9,70.9 v63,70.9
N$2
  Bottom 0.305: LED2.A 2.54,63.56 2.54,60.8 3.49,59.85 R5.2
N$3
  Bottom 0.305: LED3.A 13.97,63.56 13.97,60.8 14.92,59.85 R8.2
N$4
  Bottom 0.305: LED4.A 36.83,63.56 36.83,60.8 37.78,59.85 R11.2
N$5
  Bottom 0.305: LED5.A 25.4,63.56 25.4,60.8 26.15,60.05 R14.2
N$6
  Bottom 0.305: LED6.A 62.33,63.66 62.33,60.7 63.18,59.85 R17.2
N$7
  Bottom 0.305: LED7.A 50.8,63.56 50.8,60.8 51.75,59.85 R20.2
N$9
  Bottom 0.305: LED9.A 73.66,63.56 73.66,62.1 73.66,60.8 74.61,59.85 R26.2
N$11
  Bottom 0.305: LED11.A 85.09,63.56 85.09,60.8 86.04,59.85 R32.2
N$17
  Bottom 0.203: R5.1 R4.1 6.35,65.45 D4.2 6.69,65.97 D5.C
N$18
  Bottom 0.203: R8.1 R7.1 17.78,65.45 D6.2 18.12,65.97 D7.C
N$19
  Bottom 0.203: R14.1 R13.1 29.21,65.45 D12.2 29.64,70.88 D13.C
N$20
  Bottom 0.203: R11.1 R10.1 40.64,65.45 D9.2 40.98,65.97 D10.C
N$21
  Bottom 0.203: D18.2 54.95,65.97 | 54.95,65.97 53.85,67.06 D19.C | R20.1 R19.1 54.61,65.62 54.95,65.97
N$22
  Bottom 0.203: D16.C 66.38,65.97 D15.2 66.04,65.45 R16.1 R17.1
N$23
  Bottom 0.203: D24.2 77.81,65.97 | 77.81,65.97 D25.C | 77.81,65.97 77.47,65.62 R25.1 R26.1
N$24
  Bottom 0.203: D31.C 89.33,70.88 D30.2 88.9,65.45 R31.1 R32.1
N$25
  Top 0.152: OK3.1 25.57,31.64 R6.2
N$26
  Top 0.152: OK3.3 23.26,31.41 R9.2
N$27
  Top 0.152: OK3.5 R12.2
N$28
  Top 0.152: OK3.7 16.9,32.7 16.9,34.2 17.94,35.24 R15.2
N$29
  Top 0.152: R18.1 24.77,24.45 OK3.15
N$30
  Top 0.152: R21.1 22.86,24.07 OK3.13
N$31
  Top 0.152: R27.1 19.05,24.07 OK3.11
N$32
  Top 0.152: R30.1 15.24,22.8 OK3.9
N$33
  Top 0.152: Q4.B R30.2
N$34
  Top 0.152: Q3.B 13.8,24.45 14.26,23.99 14.26,21.8 14.39,21.66 15.94,21.66 16.96,20.64 R27.2
N$35
  Top 0.152: R21.2 23.61,21.59 27.44,21.59 27.94,22.09 27.94,25.4 28.89,26.35 Q2.B
N$36
  Top 0.152: R18.2 26.99,20.32 27.54,20.32 29.38,22.16 Q1.B
N$37
  Bottom 0.254: R33.2 22.82,3.85 X4.3
N$38
  Bottom 0.254: X1.1 31.71,3.85 R34.2
N$39
  Bottom 0.254: R35.2 7.48,3.95 X4.1
N$40
  Bottom 0.254: X6.3 56.48,74.6 59.3,74.6 60.8,73.1 70.9,73.1 71.2,72.8 80.7,72.8 82.21,71.29 D25.A
N$41
  Top 0.254: OK5.1 58.6,31.18 58.62,31.16 58.66,31.16 63.76,26.06 R41.2
N$42
  Top 0.152: OK5.15 51.9,24.23 51.9,23.1 52.46,22.54 R45.1
N$43
  Top 0.254: R42.2 66.27,26.16 60.27,32.16 51.14,32.16 OK5.3
N$44
  Top 0.152: R46.1 49.53,24.07 OK5.13
N$45
  Top 0.254: R43.2 68.78,26.16 62.27,32.67 49.11,32.67 OK5.5
N$46
  Top 0.152: R47.1 45.72,24.07 OK5.11
N$47
  Top 0.254: R44.2 71.29,26.26 64.38,33.17 47.08,33.17 OK5.7
N$48
  Top 0.152: R48.1 41.91,23.91 42.7,24.7 OK5.9
N$49  (via drill 0.35)
  Top 0.254: Q1.E 28.04,19.3 17.6,19.3 16.8,18.5 16.8,17.55 15.97,16.72 15.97,11.4 15.87,11.3 v15.2,11.3
  Bottom 0.254: R33.1 15.24,9.11 D1.A 15.2,9.47 v15.2,11.3
N$50
  Bottom 0.254: R36.2 15.2,3.85 X4.2
N$51  (via drill 0.35)
  Top 0.254: Q2.E 29.85,24.45 30.5,23.8 30.5,19.3 30.09,18.89 19.68,18.89 19.08,18.29 19.08,11.32 v19.1,11.3
  Bottom 0.254: R34.1 26.55,6.6 21.88,6.6 D2.A 19.05,11.25 v19.1,11.3
N$52  (via drill 0.35)
  Top 0.254: v7.6,11.1 7.6,15.5 9,16.9 9,26.12 9.23,26.35 Q3.E
  Bottom 0.254: v7.6,11.1 7.62,11.08 D3.A 4.7,6.51 R35.1
N$53  (via drill 0.35)
  Top 0.254: v11.5,11.3 11.5,14.43 11.51,14.43 11.51,21.52 Q4.E
  Bottom 0.254: R36.1 11.3,9.3 D8.A 11.43,11.23 v11.5,11.3
N$54  (via drill 0.35)
  Top 0.254: v28,11 28.3,11.3 29.8,11.3 30.4,11.9 30.4,15.35 32.22,17.16 32.22,19.53 32.49,19.8 34.8,19.8 35.7,20.7 37.7,20.7 38,21 38,21.8 38.74,22.54 Q12.E
  Bottom 0.152: 28,9.49 v28,11
  Bottom 0.254: R37.1 42.15,7.1 30.27,7.1 D26.A 28,9.49
N$55  (via drill 0.35)
  Top 0.254: v24.4,11.1 25.2,11.9 29.1,11.9 29.9,12.7 29.9,15.48 31.81,17.39 31.81,19.78 32.4,20.36 34.6,20.36 35.7,21.46 35.7,25.8 36.25,26.35 Q11.E
  Bottom 0.254: R38.1 34.65,6.3 29.1,6.3 28.3,7.1 26.43,7.1 26.42,7.11 24.79,7.11 24.13,7.77 D23.A 24.4,9.7 v24.4,11.1
N$56  (via drill 0.35)
  Top 0.254: v35.6,11.4 34.5,11.4 34.1,11.8 34.1,16.4 34.72,17.02 34.72,18.41 35.2,18.9 56.58,18.9 57.2,19.52 57.2,23.9 56.65,24.45 Q10.E
  Bottom 0.254: v35.6,11.4 35.6,9.47 D22.A 36.97,9.43 38.39,8.01 58.39,8.01 59.7,6.7 R39.1
N$65
  Top 0.152: R48.2 Q12.B
N$66
  Top 0.152: R47.2 43.53,20.74 42.76,21.52 40.71,21.52 40.64,21.59 40.64,23.01 Q11.B
N$67
  Top 0.152: R46.2 50.28,21.59 54.11,21.59 54.61,22.09 54.61,24.91 Q10.B
N$68
  Top 0.152: R45.2 53.98,21.29 54.24,21.29 55.49,22.54 Q9.B
N$69
  Bottom 0.254: R37.2 46.95,3.85 X1.3
N$70
  Bottom 0.254: R38.2 39.33,3.85 X1.2
N$71
  Bottom 0.254: R39.2 59.86,3.81 X2.2
N$72
  Bottom 0.254: R40.2 55.84,3.85 X2.1
N$73  (via drill 0.35)
  Top 0.254: Q9.E 56.05,19.65 55.71,19.31 35.03,19.31 34.31,18.58 34.31,17.32 33.6,16.61 33.6,11.8 33.2,11.4 v31.8,11.4
  Bottom 0.254: R40.1 50.45,7.6 33.58,7.6 D21.A 31.75,11.4 v31.8,11.4
N$75
  Top 0.152: IC1.6 81.69,29.46 R49.2 | R50.1 R49.2 | R49.2 82.1,29.05 87.7,29.05 D11.1 88.5,29.35 89.15,30 95.3,30 X7.1
N$76
  Top 0.152: IC1.7 81.69,30.73 R49.1 | R51.2 82,33.13 R49.1 | R49.1 83.6,29.45 86.58,29.45 88,30.87 D11.2 93.1,31.25 93.65,31.8 93.65,31.85 X7.2
N$78
  Top 0.152: IC3.6 81.78,41.06 R55.2 | R55.2 87.7,40.75 D17.1 88,40.85 92.9,40.85 95.7,38.05 X7.3 | R55.2 82.15,40.7 R56.1
N$79
  Top 0.152: IC3.7 81.78,42.34 R55.1 | X7.4 93.75,42.85 D17.2 87.9,42.58 86.42,41.1 83.65,41.1 R55.1 | R55.1 82.1,44.75 R57.2
PB0
  Top 0.152: U1.P1_27 25.57,50.87 R6.1
PB1
  Top 0.152: U1.P1_28 23.26,50.64 R9.1
PB2
  Top 0.152: U1.P1_29 20.95,50.41 R12.1
PB3
  Top 0.254: U1.P2_11 61.2,24.63 57.12,28.71 20.11,28.71 19.05,29.77 19.05,32.53 R15.1
PB4
  Top 0.254: R41.1 63.74,22.86 U1.P2_10
PB5
  Top 0.254: R42.1 U1.P2_9
PB6
  Top 0.254: R43.1 68.82,22.82 U1.P2_8
PB7
  Top 0.254: R44.1 71.36,22.79 U1.P2_7
PC0
  Top 0.152: OK2.16 23.54,63.3 23.54,62.04 23.1,61.6 | R1.1 21.14,61.6 23.1,61.6 | 23.1,61.6 23.2,61.6 23.6,61.2 23.6,60 23.84,59.76 57.33,59.76 U1.P1_11
PC1
  Top 0.152: OK2.14 20.91,63.31 20.2,62.6 20.2,60.33 R2.1 55.09,59.45 U1.P1_12
PC2
  Top 0.152: OK2.12 18.48,62.88 17.6,62 16.92,62 R3.1 17.7,60.34 17.7,57.6 17.9,57.4 54.6,57.4 U1.P1_13
PC3
  Top 0.152: OK2.10 15.6,62.98 15.6,60.35 R22.1 17,58.95 17,57.4 17.4,57 52.46,57 U1.P1_14
PC4  (via drill 0.35)
  Top 0.152: OK1.16 72.4,62.92 72.4,60.67 R23.1 71.5,59.77 v71.5,58.2
  Bottom 0.152: U1.P1_25 26.96,57.2 71.3,57.2 71.5,57.4 v71.5,58.2
PC5  (via drill 0.35)
  Top 0.152: OK1.14 71.52,63.63 R24.1 70.58,61.98 v70.3,61.7
  Bottom 0.152: U1.P1_26 24.96,57.74 69.84,57.74 70.3,58.2 v70.3,61.7
PC6  (via drill 0.35)
  Top 0.152: OK1.12 68.5,63.51 68,63 66.95,63 65.83,61.88 | R28.1 65.83,61.88 | v62.6,51.4 v62.6,51.41 62.6,56.6 63.5,57.5 65.6,57.5 66.8,58.7 66.8,61.1 66.03,61.88 65.83,61.88
  Bottom 0.152: U1.P2_29 15.58,17.78 49.15,51.35 62.55,51.35 v62.6,51.4
PC7  (via drill 0.35)
  Top 0.152: OK1.10 64.8,62.95 64.8,61.09 65.09,60.8 65.4,60.8 65.5,60.7 65.5,59.92 R29.1 65.78,58.68 65,57.9 63.4,57.9 62.3,56.8 62.3,54.6 61.9,54.2 61.9,50.7 v61.8,50.6
  Bottom 0.152: U1.P2_28 18,17.8 18,19.57 49.03,50.6 v61.8,50.6
SEL0
  Bottom 0.152: U1.P1_4 80.36,54.5 93.13,54.5 93.32,54.69 94.58,54.69 94.9,54.37 94.9,49.4 95.68,48.62 SV1.1
SEL1
  Bottom 0.152: U1.P1_5 77.76,57.2 87.9,57.2 90.1,55 94.8,55 95.2,54.59 95.2,51.6 95.64,51.16 SV1.3
SEL2
  Bottom 0.152: U1.P1_6 75.72,57.7 93.9,57.7 95,56.6 95,55.4 96.27,54.13 SV1.5
SPI1_MISO
  Bottom 0.152: U1.P1_23 30.72,53.58 31.3,53 89.39,53 90.63,51.76 93.13,51.76 SV1.4
SPI1_MOSI
  Bottom 0.152: U1.P1_24 28.2,55.86 28.2,54 29.6,52.6 88.45,52.6 89.83,51.22 91.83,51.22 92.53,50.52 92.53,49.82 SV1.2
SPI1_SCK
  Bottom 0.152: U1.P1_22 33.26,54.24 34.1,53.4 93.43,53.4 SV1.6
USART1_RX
  Bottom 0.152: U1.P2_23 32.2,16.3 91,16.3 92.6,17.9 92.6,22.33 93.07,22.8 SV2.2
USART1_TX
  Bottom 0.152: U1.P2_24 29.96,15.99 91.13,15.99 92.91,17.77 92.91,19.86 93.31,20.26 SV2.1
USART2_RX
  Top 0.152: IC3.1 71.06,46 51.6,46 45.2,52.4 45.2,54.1 U1.P1_18
USART2_TX
  Top 0.152: U1.P1_17 45.96,52.64 51.9,46.7 75.8,46.7 76.13,46.37 76.13,39.43 74.7,38 72.8,38 72.4,37.6 72.4,28.6 72.81,28.2 IC1.4

### Text on the board
tPlace: GND | RX | TX | Yılkı | PLC Dev Board Ver 0.1 | 5 GND | 4 RXB | 3 RXA | 2 TXB | 1 TXA